# Altium project LimePSB-RPCM_1v5.PrjPcb (part 10 of 10)
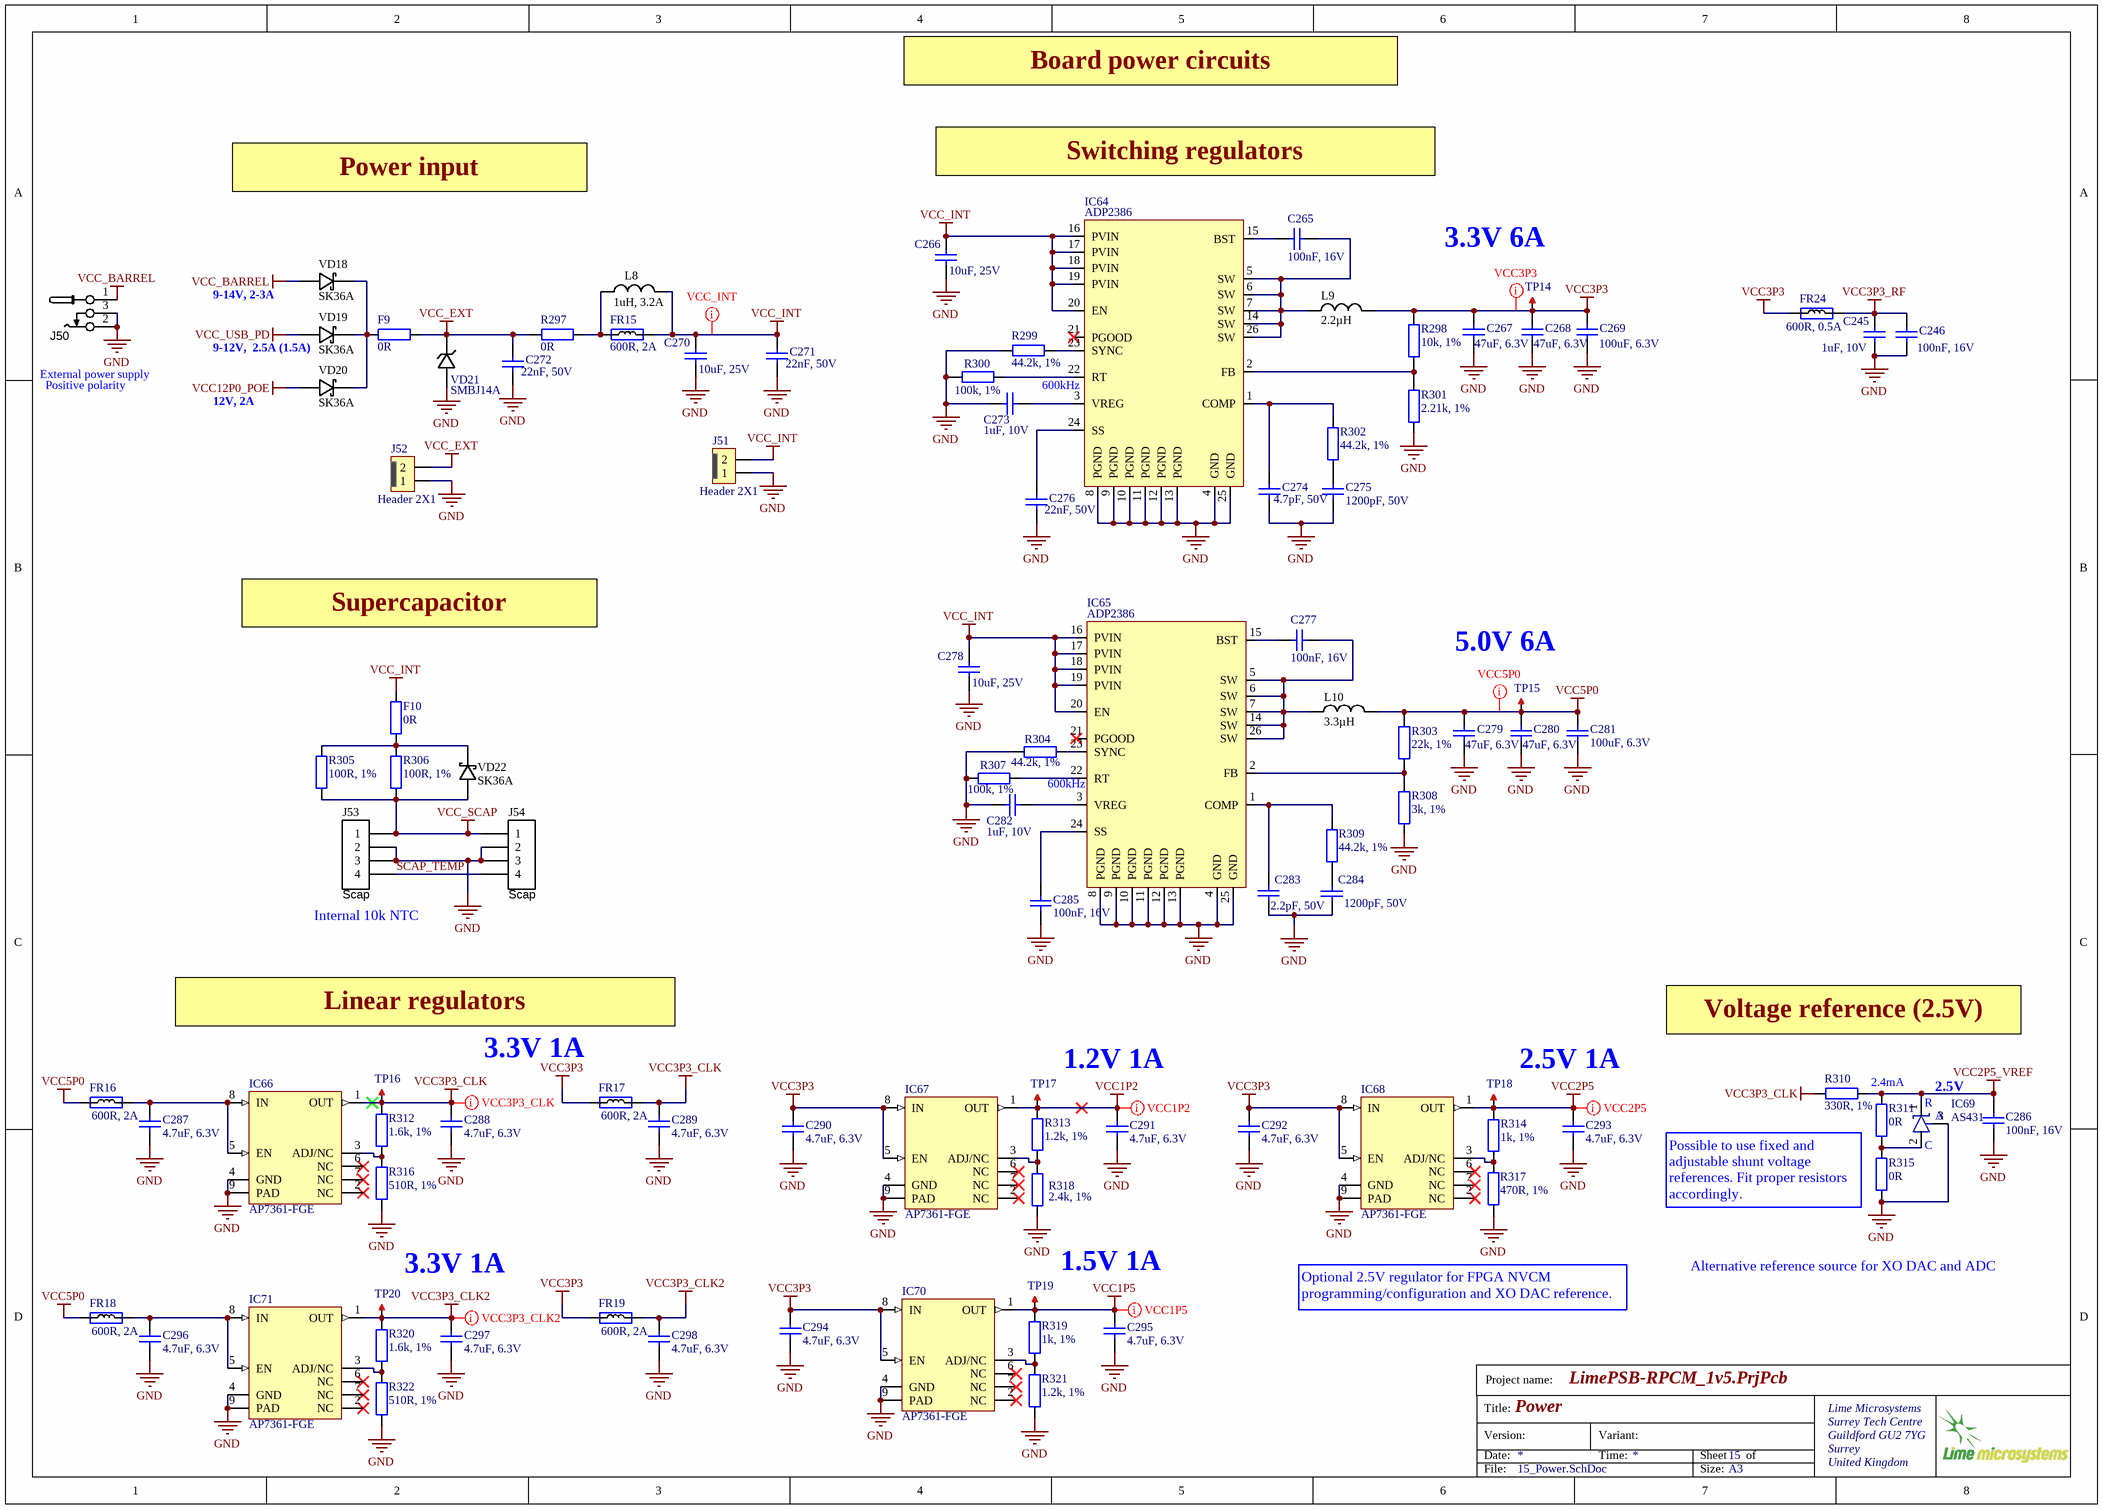
[diagram p13: 15_Power.SchDoc]

## Assembly variants
Default: not fitted BATT2 C6 C7 C8 C18 C30 C31 C63 C92 C97 C102 C118 C119 C124 C125 C126 C134 C135 C136 C137 C147 C156 C157 C163 C172 C173 C178 C179 C180 C189 C190 C191 C192 C194 C195 C200 C201 C211 C211 C212 C212 C247 C248 C257 C258 C259 C260 C269 C280 C281 C289 C293 C298 ESD35 FR15 FR17 FR19 IC9 IC10 IC16 IC19 IC22 IC23 IC34 IC38 IC44 IC46 IC49 IC68 J5 J6 J11 J13 J17 J18 J19 J20 J23 J25 J28 J30 J32 J40 J41 J54 JMP1 LED8 LED9 R1 R4 R5 R7 R9 R10 R11 R12 R13 R17 R18 R21 R22 R24 R27 R30 R34 R41 R47 R51 R52 R53 R54 R62 R70 R76 R83 R84 R86 R87 R92 R93 R96 R97 R108 R114 R116 R117 R122 R124 R125 R126 R137 R139 R142 R144 R146 R148 R151 R152 R153 R154 R155 R156 R158 R161 R163 R164 R166 R167 R170 R172 R180 R181 R182 R183 R184 R185 R186 R187 R188 R189 R190 R191 R192 R198 R202 R204 R208 R210 R213 R221 R222 R223 R224 R225 R226 R227 R229 R230 R231 R232 R233 R234 R235 R236 R237 R238 R239 R240 R241 R244 R245 R246 R248 R251 R253 R255 R256 R258 R259 R263 R264 R269 R270 R271 R272 R273 R274 R275 R276 R277 R278 R279 R280 R281 R282 R283 R284 R299 R304 R305 R314 R315 R317 R325 R326 R327 R329 R330 R343 R344 R345 R347 VD9 VD21 XO2 XO3 XO4 XO5 XO7 XO8 XO9 XO10